# Altium schematic sheet Connectors.SchDoc
size A4
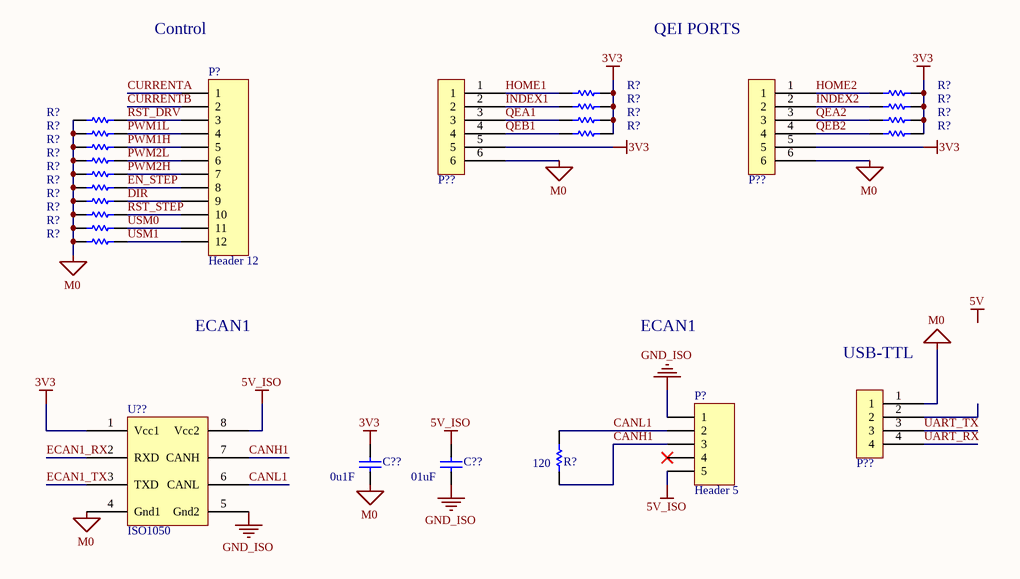
[diagram p0: Connectors.SchDoc]

## Parts
(Parts that share a designator on the sheet are numbered #1, #2 ... from top to bottom, then left to right.)
C??#1  0u1F  [C0805]
C??#2  01uF  [C0805]
P?#1  Header 12  [HDR1X12]
P?#2  Header 5  [HDR1X5]
P??#1  Header 6_WEID  [HEADER_6_WEID]  (value not drawn)
P??#2  Header 6_WEID  [HEADER_6_WEID]  (value not drawn)
P??#3  Header 4_WEID  [HEADER_4_WEID]  (value not drawn)
R?#1  10K  [R0805]  (value not drawn)
R?#2  10K  [R0805]  (value not drawn)
R?#3  10K  [R0805]  (value not drawn)
R?#4  10K  [R0805]  (value not drawn)
R?#5  10K  [R0805]  (value not drawn)
R?#6  10K  [R0805]  (value not drawn)
R?#7  10K  [R0805]  (value not drawn)
R?#8  10K  [R0805]  (value not drawn)
R?#9  10K  [R0805]  (value not drawn)
R?#10  10K  [R0805]  (value not drawn)
R?#11  10K  [R0805]  (value not drawn)
R?#12  10K  [R0805]  (value not drawn)
R?#13  10K  [R0805]  (value not drawn)
R?#14  10K  [R0805]  (value not drawn)
R?#15  10K  [R0805]  (value not drawn)
R?#16  10K  [R0805]  (value not drawn)
R?#17  10K  [R0805]  (value not drawn)
R?#18  10K  [R0805]  (value not drawn)
R?#19  120  [R0805]
U??  ISO1050  [ISO1050]

## Nets
3V3: C??#1.1 P??#1.5 P??#2.5 R?#1.1 R?#2.1 R?#3.1 R?#4.1 R?#6.1 R?#7.1 R?#9.1 R?#10.1 U??.1(Vcc1)
5V_ISO: C??#2.1 P?#2.5 U??.8(Vcc2)
GND_ISO: C??#2.2 P?#2.1 U??.5(Gnd2)
M0: C??#1.2 P??#1.6 P??#2.6 P??#3.1 R?#5.2 R?#8.2 R?#11.2 R?#12.2 R?#13.2 R?#14.2 R?#15.2 R?#16.2 R?#17.2 R?#18.2 U??.4(Gnd1)
CANH1: P?#2.3 R?#19.2 U??.7(CANH)
CANL1: P?#2.2 R?#19.1 U??.6(CANL)
CURRENTA: P?#1.1
CURRENTB: P?#1.2
DIR: P?#1.9 R?#15.1
ECAN1_RX: U??.2(RXD)
ECAN1_TX: U??.3(TXD)
EN_STEP: P?#1.8 R?#14.1
HOME1: P??#1.1 R?#1.2
HOME2: P??#2.1 R?#2.2
INDEX1: P??#1.2 R?#3.2
INDEX2: P??#2.2 R?#4.2
PWM1H: P?#1.5 R?#11.1
PWM1L: P?#1.4 R?#8.1
PWM2H: P?#1.7 R?#13.1
PWM2L: P?#1.6 R?#12.1
QEA1: P??#1.3 R?#6.2
QEA2: P??#2.3 R?#7.2
QEB1: P??#1.4 R?#9.2
QEB2: P??#2.4 R?#10.2
RST_DRV: P?#1.3 R?#5.1
RST_STEP: P?#1.10 R?#16.1
UART_RX: P??#3.4
UART_TX: P??#3.3
USM0: P?#1.11 R?#17.1
USM1: P?#1.12 R?#18.1

Not connected (* = marked no-connect by the designer): P?#2 4*; P??#3 2

## Notes on the sheet
- Control
- QEI PORTS
- ECAN1
- (near P??#3) USB-TTL
- Labels drawn without touching a wire or pin: 5V

## Library data of the parts
C??#1 C??#2 = C0805: Ceramic Chip Capacitor - Standard; Note: Footprint corresponds to dimensions for bulk cassette packaging. This case size has tightened tolerances.; Value: 100pF; Published: 17-Jul-2002; LatestRevisionDate: 19-Mar-2004; LatestRevisionNote: Silkscreen size reduced.; DatasheetDocument: Mar-2001; PackageDocument: Mar-2001; PackageReference: 0805; Publisher: Altium Limited; Code_JEITA: 0805; Code_IPC: 2012[0805]; ComponentLink1Description: Manufacturer Link; ComponentLink1URL: http://www.kemet.com/; ComponentLink2Description: Datasheet; ComponentLink2URL: http://www.kemet.com/kemet/web/homepage/kechome.nsf/vapubfilesname/F3102TA.pdf/$file/F3102TA.pdf
P?#1 = Header 12: Header, 12-Pin; LatestRevisionDate: 17-Jul-2002; LatestRevisionNote: Re-released for DXP Platform.; Publisher: Altium Limited
P?#2 = Header 5: Header, 5-Pin; LatestRevisionDate: 17-Jul-2002; LatestRevisionNote: Re-released for DXP Platform.; Publisher: Altium Limited
R?#1-R?#19 = R0805: Resistor 0805
U?? = ISO1050: Isolated CAN transceiver